# EAGLE design Prototipo_3X (EAGLE 6.1)
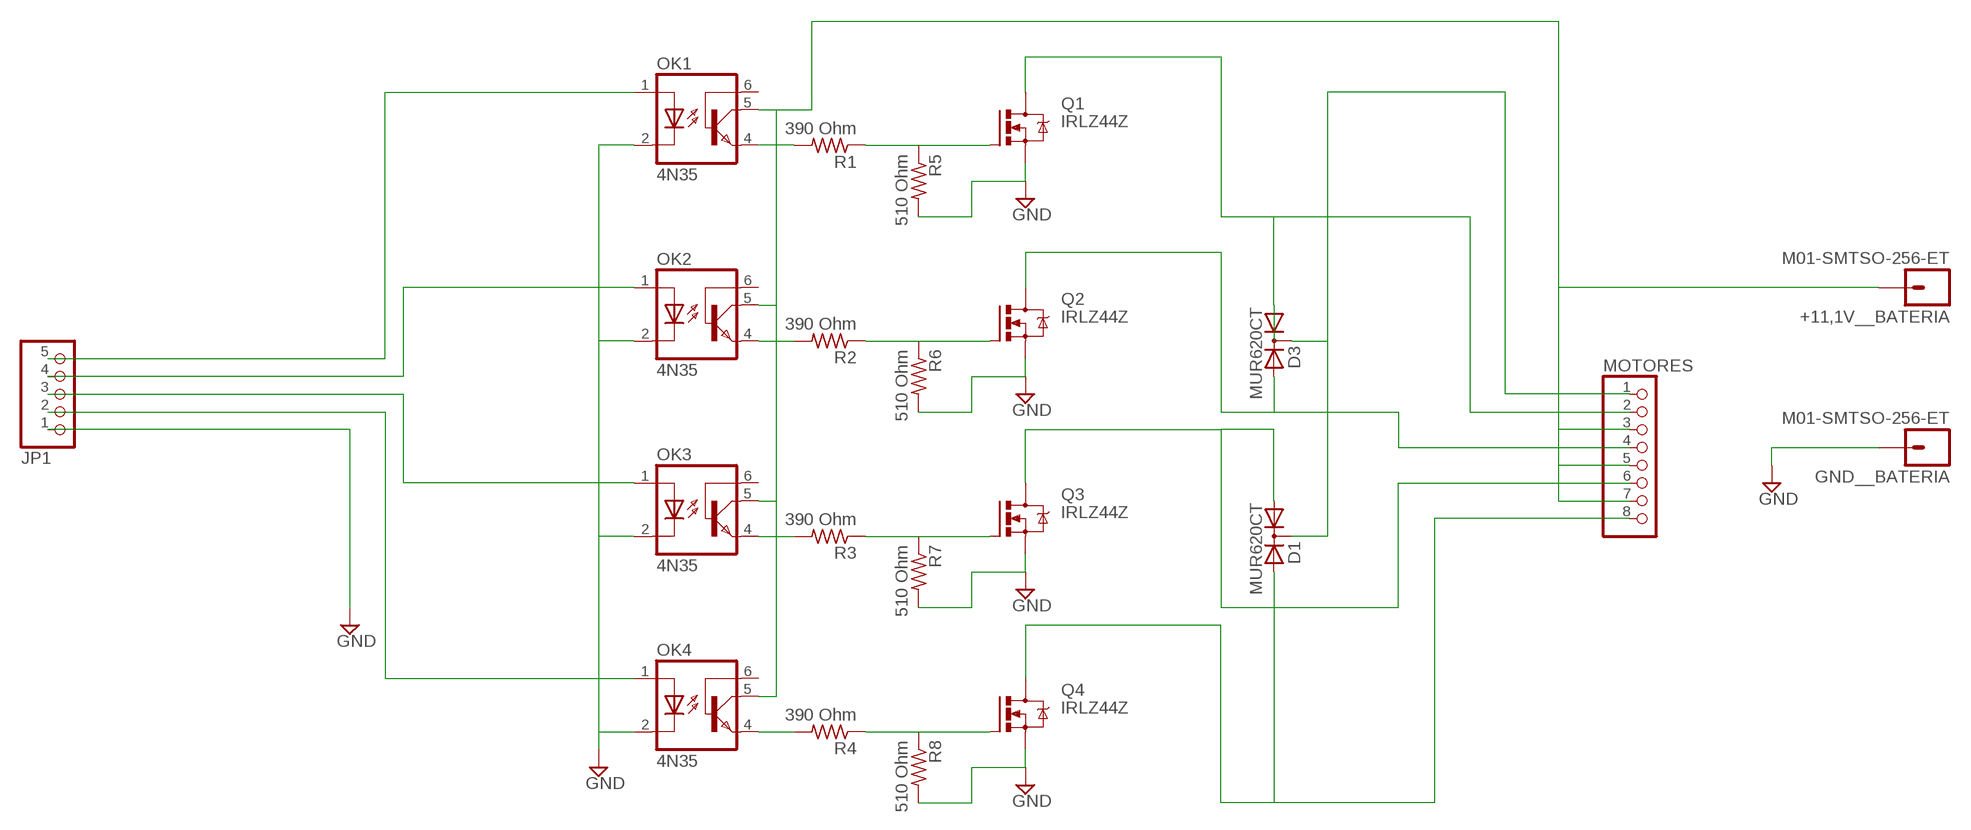
[diagram p0: schematic, sheet 1]

## Parts
+11,1V__BATERIA  M01-SMTSO-256-ET  [SMTSO-256-ET]
D1  MUR620CT  [TO220AB]
D3  MUR620CT  [TO220AB]
GND__BATERIA  M01-SMTSO-256-ET  [SMTSO-256-ET]
JP1  PINHD-1X5/90  [1X05/90]
MOTORES  PINHD-1X8/90  [1X08/90]
OK1  4N35  [DIL06]
OK2  4N35  [DIL06]
OK3  4N35  [DIL06]
OK4  4N35  [DIL06]
Q1  IRLZ44Z  [TO220BH]
Q2  IRLZ44Z  [TO220BH]
Q3  IRLZ44Z  [TO220BH]
Q4  IRLZ44Z  [TO220BH]
R1  390 Ohm  R-US_0207/7  [0207/7]
R2  390 Ohm  R-US_0207/7  [0207/7]
R3  390 Ohm  R-US_0207/7  [0207/7]
R4  390 Ohm  R-US_0207/7  [0207/7]
R5  510 Ohm  R-US_0207/7  [0207/7]
R6  510 Ohm  R-US_0207/7  [0207/7]
R7  510 Ohm  R-US_0207/7  [0207/7]
R8  510 Ohm  R-US_0207/7  [0207/7]

## Nets
GND [power]: GND__BATERIA.P$1 JP1.1 OK1.2(C) OK2.2(C) OK3.2(C) OK4.2(C) Q1.S Q2.S Q3.S Q4.S R5.2 R6.2 R7.2 R8.2
N$1: JP1.5 OK1.1(A)
N$2: JP1.4 OK2.1(A)
N$3: JP1.3 OK3.1(A)
N$4: JP1.2 OK4.1(A)
N$5: OK1.4(EMI) R1.2
N$6: Q1.G R1.1 R5.1
N$7: OK2.4(EMI) R2.2
N$8: OK3.4(EMI) R3.2
N$9: OK4.4(EMI) R4.2
N$10: Q4.G R4.1 R8.1
N$11: D3.A1 MOTORES.2 Q1.D
N$13: Q3.G R3.1 R7.1
N$14: D3.A2 MOTORES.4 Q2.D
N$15: D1.A1 MOTORES.6 Q3.D
N$16: D1.A2 MOTORES.8 Q4.D
N$17: Q2.G R2.1 R6.1
N$18: +11,1V__BATERIA.P$1 D1.C D3.C MOTORES.1 MOTORES.3 MOTORES.5 MOTORES.7 OK1.5(COL) OK2.5(COL) OK3.5(COL) OK4.5(COL)
Unconnected: OK1.6(BAS) OK2.6(BAS) OK3.6(BAS) OK4.6(BAS)

## Library data of the parts
+11,1V__BATERIA GND__BATERIA = SparkFun-Connectors:M01: Header 1 Standard 1-pin 0.1" header. Use with straight break away headers (SKU : PRT-00116), right angle break away headers (PRT-00553), swiss pins (PRT-00743), machine pins (PRT-00117), and female headers (PRT-00115).
D1 D3 = diode:MUR620CT: DIODE dual rectifier, 6 A, 200 V, common cathode
JP1 = pinhead:PINHD-1X5: PIN HEADER
MOTORES = pinhead:PINHD-1X8: PIN HEADER
OK1-OK4 = optocoupler:4N35: MOTOROLA OPTO COUPLER; MF: FAIRCHILD SEMICONDUCTOR; MPN: 4N35; OC_FARNELL: 1328375; OC_NEWARK: 72K9946
Q1-Q4 = transistor-power:IRLZ44Z: N-Channel HEXFET® Power MOSFET Logic Level AUTOMOTIVE MOSFET Source: http://www.irf.com/product-info/datasheets/data/irlz44zpbf.pdf
R1-R8 = resistor:R-US_: RESISTOR, American symbol

## Net classes
0 default: clearance 0.205 mm
1 power: width 0.655 mm, drill 10.22 mm, clearance 0.205 mm to class 0, clearance 0.205 mm

## Board
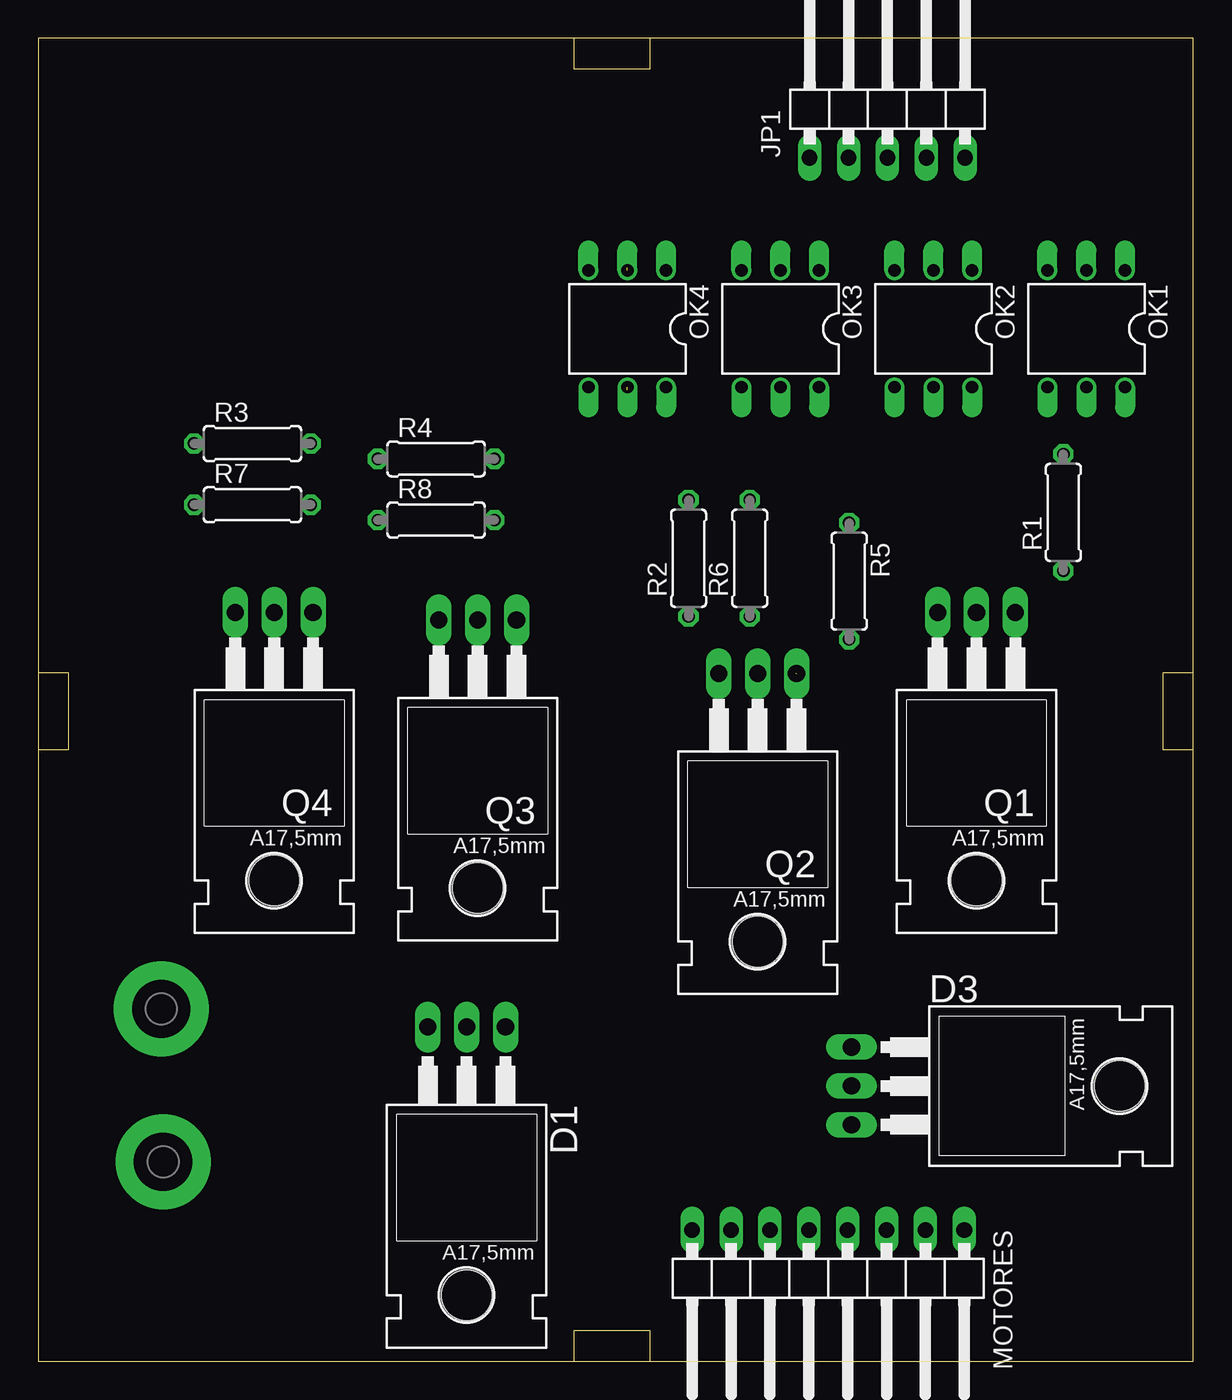
[diagram p1: board, top side]
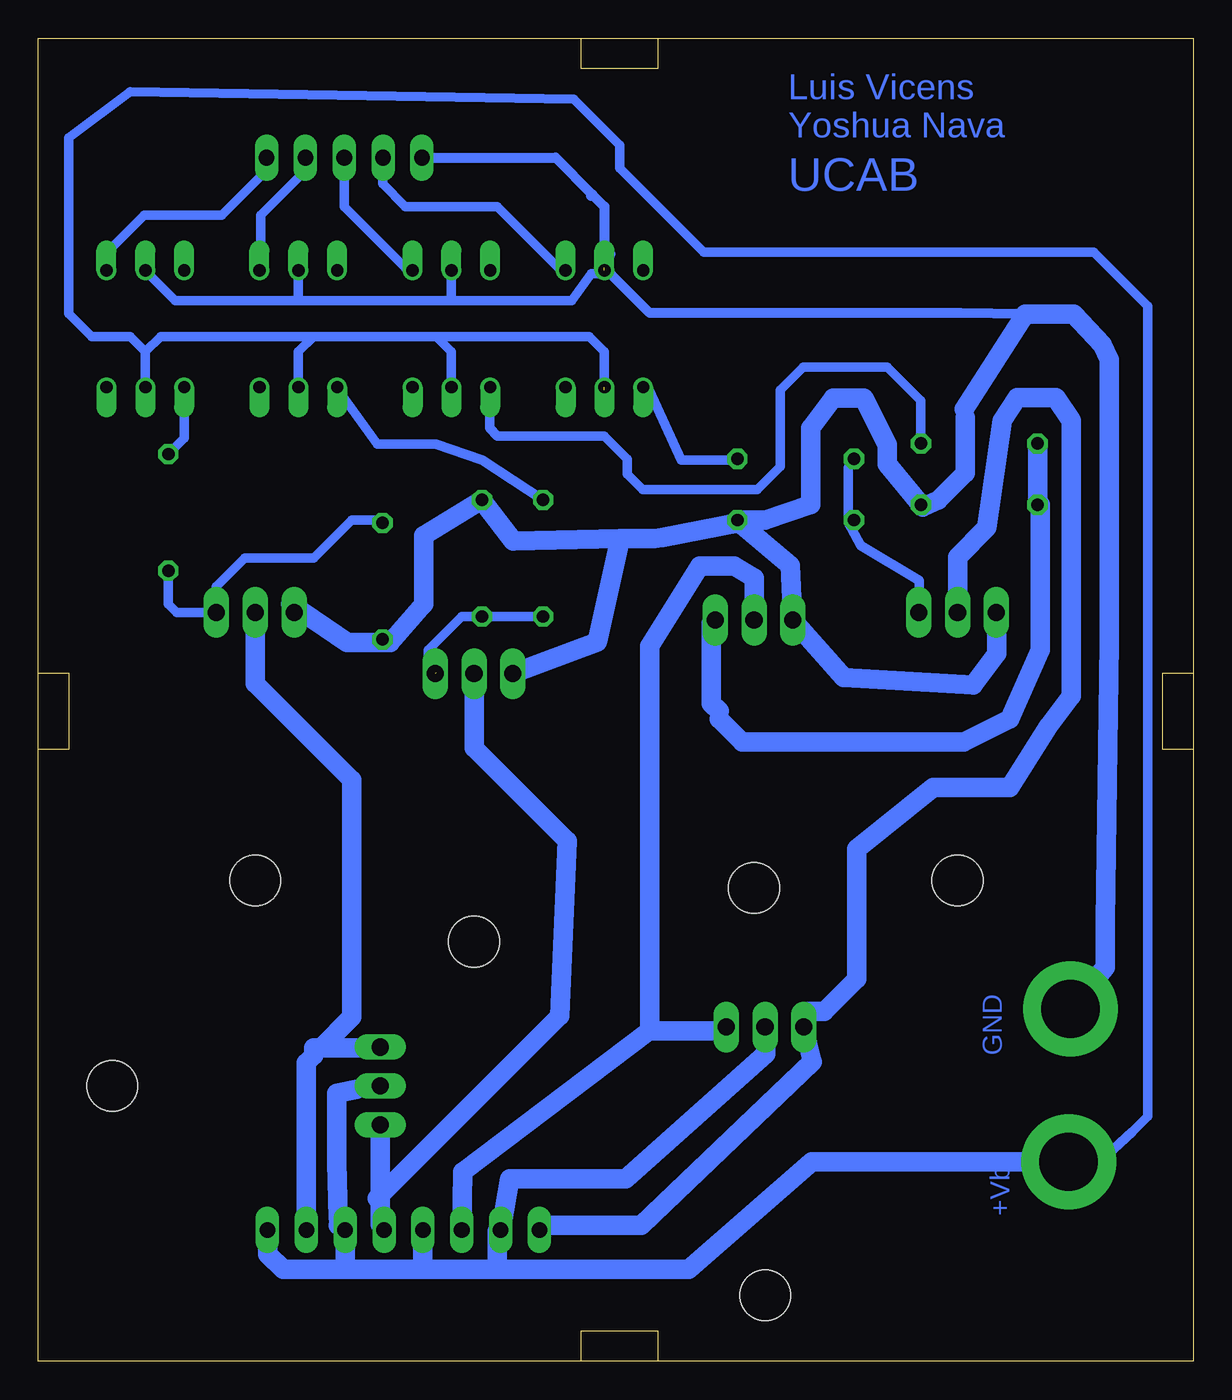
[diagram p2: board, bottom side, seen from below]

Size 75.5 x 86.5 mm. Coordinates in mm from the lower left corner, seen from the top.
Outline: 0,0 75.5,0 75.5,86.5 0,86.5 0,0
Copper layers (1*16): Top 0.035mm / dielectric 1.5mm / Bottom 0.035mm
Design rules: minimum track width 10mil, minimum drill 24mil, track to track 8mil, track to pad 8mil, pad to pad 8mil, via to via 8mil, smd to smd 8mil, copper to edge 40mil, drill to drill 8mil, minimum pad ring 10mil, minimum via ring 8mil, stop-mask expansion 4mil, vias tented up to drill 0mil, thermal gap 10mil

### Footprints (pad centres in the part's own frame; a part is rotated, then mirrored left to right if it is on the bottom)
SMTSO-256-ET = drill 3.81 pad 6.198: P$1 0,0
TO220AB = drill 1.118 long: A1 -2.54,-6.35; A2 2.54,-6.35; C 0,-6.35 | hole 3.302: 0,11.176
1X05/90 = drill 1.016 long: 1 -5.08,-3.81; 2 -2.54,-3.81; 3 0,-3.81; 4 2.54,-3.81; 5 5.08,-3.81
1X08/90 = drill 1.016 long: 1 -8.89,-3.81; 2 -6.35,-3.81; 3 -3.81,-3.81; 4 -1.27,-3.81; 5 1.27,-3.81; 6 3.81,-3.81; 7 6.35,-3.81; 8 8.89,-3.81
DIL06 = drill 0.813 offset: 1 -2.54,-3.81; 2 0,-3.81; 3 2.54,-3.81; 4 2.54,3.81; 5 0,3.81; 6 -2.54,3.81
TO220BH = drill 1.118 long: D 0,-6.35; G -2.54,-6.35; S 2.54,-6.35 | hole 3.302: 0,11.176
0207/7 = drill 0.813 octagon: 1 -3.81,0; 2 3.81,0

### Placement (x,y rotation side)
+11,1V__BATERIA  8.16,13.04 180 top
D1  28,15.5 180 top
D3  59.5,18 270 top
GND__BATERIA  8.04,23.04 0 top
JP1  55.5,82.5 0 top
MOTORES  51.63,4.78 180 top
OK1  68.5,67.5 180 top
OK2  58.5,67.5 180 top
OK3  48.5,67.5 180 top
OK4  38.5,67.5 180 top
Q1  61.32,42.61 180 top
Q2  47.02,38.61 180 top
Q3  28.72,42.11 180 top
Q4  15.42,42.61 180 top
R1  67,55.5 90 top
R2  42.5,52.5 90 top
R3  14,60 0 top
R4  26,59 0 top
R5  53,51 270 top
R6  46.5,52.5 90 top
R7  14,56 0 top
R8  26,55 0 top

### Tracks (layer width: path | path; a pad name or v marks a point on that pad's centre or on a via)
GND  (1 unrouted)
  Bottom 0.254: 68.58,71.12 OK1.2
  Bottom 0.406: Q1.S 55.32,47
  Bottom 0.61: 38.1,71.12 39.37,71.12 40.64,69.35 48.5,69.35 | 48.5,69.35 58.5,69.35 | 58.5,69.35 66.54,69.35 68.31,71.12 68.58,71.12 | OK3.2 48.5,69.35 | OK2.2 58.5,69.35 | 14.93,61.69 arc90 14.99,62.25
  Bottom 0.655: 58.27,49.03 Q1.S | 17.7,55.84 R7.2 | 38.1,72.39 OK4.2 38.1,71.12 35.52,68.54 15.24,68.54 10.99,68.47 | JP1.1 41.69,78.69 39.28,76.28 | 39.28,76.28 38.5,75.5 38.5,71.5 | 39.37,76.2 39.28,76.28
  Bottom 1.27: 37.45,53.8 38.95,47.03 Q2.S | 14.93,61.69 14.93,58.07 16.68,56.32 17.7,55.84 20.01,58.65 20.01,59.92 21.55,62.96 23.54,62.96 25,61 25,56 28,55 R8.2 29.67,54.84 | Q4.S 12.85,46.26 14.39,44.22 22.86,44.72 Q3.S 26.36,52.03 29.67,54.84 | 37.45,53.8 35.25,53.8 34.71,53.84 29.67,54.84 | GND__BATERIA.P$1 5.78,25.74 5.78,28.72 5.5,47 5.5,65.5 5.96,66.46 7.81,68.46 10.66,68.46 10.99,68.47 14.99,62.25 | 52.5,47 50.31,49.5 50.31,54 R6.2 44.45,53.64 37.45,53.8 | 52.5,47 R5.2 | 52.5,47 55.32,47 59,49.5
N$1
  Bottom 0.61: OK1.1 71.12,72.39 68.58,74.93 63.5,74.93 60.96,77.47 JP1.5
N$2
  Bottom 0.61: OK2.1 60.96,72.39 60.96,74.93 58.42,77.47 JP1.4
N$3
  Bottom 0.61: JP1.3 55.5,75.5 51.5,71.5 51,71.5 51.04,71.46 OK3.1
N$4
  Bottom 0.61: OK4.1 41.31,71.31 45.5,75.5 51.5,75.5 53,77 53,78.5 52.96,78.54 JP1.2
N$5
  Bottom 0.61: OK1.4 65.96,60.35 R1.2
N$6
  Bottom 0.61: R1.1 67,49.5 66.46,48.96 Q1.G 63.86,50.64 62,52.5 57.5,52.5 55,55 53.19,55 R5.1
N$7
  Bottom 0.406: 55.88,63.5 OK2.4
  Bottom 0.61: 55.88,63.5 53.34,59.96 49.53,59.96 46.49,58.92 R2.2
N$8
  Bottom 0.406: 46,63.65 OK3.4
  Bottom 0.61: R3.2 17.81,62.81 20,65 25.5,65 27,63.5 27,58.5 28.5,57 36,57 37,58 37,59 38.5,60.5 45.5,60.5 46,61 46,63.65
N$9
  Bottom 0.254: 29.67,58.92 R4.2 | 35.56,63.5 OK4.4
  Bottom 0.61: 29.67,58.92 33.48,58.92 35.56,63.5
N$10
  Bottom 0.254: 22.55,58.42 R4.1 | 22.55,54.84 R8.1
  Bottom 0.61: 22.55,58.42 22.55,54.84 21.74,53.34 17.93,51.03 Q4.G
N$11
  Bottom 0.254: 53.34,20.32 D3.A1
  Bottom 1.27: MOTORES.2 57.98,19.52 57.5,20 57.5,20.5 57,20.5 | 57,20.5 53.19,20.5 D3.A1 | Q1.D 61.32,44.32 55,38 55,22.5 57,20.5
N$13
  Bottom 0.813: R7.1 10,56 | 31,42 31,42.5 | 31.5,48.22 Q3.G
  Bottom 1.27: R3.1 R7.1 | 10,56 10,46.5 12,42 15,40.5 29.5,40.5 31,42 | 31,42.5 31.5,43 31.5,48.22
N$14
  Bottom 0.254: 53.34,10.66 52.84,8.39 | 53.34,15.24 D3.A2
  Bottom 0.61: 46.99,44.76 Q2.D | 53.34,10.66 arc90 53.15,8.97
  Bottom 1.27: 52.84,8.39 MOTORES.4 | 46.99,44.76 46.99,40.1 40.91,34.02 41.41,22.59 53.34,10.66 | 53.15,8.97 D3.A2
N$15
  Bottom 0.254: 30.48,21.59 D1.A1
  Bottom 0.61: 35.52,21.59 35.56,21.59
  Bottom 1.27: 35.56,21.59 47.76,12.39 MOTORES.6 | 30.48,21.59 35.52,21.59 35.52,46.76 32.28,52 30,52 28.72,51.22 Q3.D
N$16
  Bottom 0.406: 25.4,22.86 25.14,22.86
  Bottom 0.61: 25.4,22.86 D1.A2
  Bottom 1.27: MOTORES.8 42.68,8.89 36.1,8.89 24.9,19.59 D1.A2 | 25.14,22.86 24.14,22.86 22,25 22,33.5 17,37.5 12,37.5 9.5,41.5 8,43.5 8,61.5 9,63 11.5,63 12.5,61.5 13.5,54.5 15.42,52.58 Q4.D
N$17  (1 unrouted)
  Bottom 0.61: R2.1 R6.1 47.81,48.69 50,46.5 50,45.5 49.5,45
N$18  (1 unrouted)
  Bottom 0.254: 53.34,17.78 D3.C | 45.22,8.89 MOTORES.7 | 55.88,8.89 55.88,9.38
  Bottom 0.61: 60.5,8.57 MOTORES.1 | 55.44,6.06 55.5,6 | 50.36,6.14 50.5,6 | 45.22,8.89 45.72,8.72 45.5,8.5 | 53.34,17.78 54.72,17.78 | 68.5,66 69.5,67 72,67 73.5,68.5 73.5,80 69.5,83 40.5,82.5 37.5,79.5 37.5,78 32,72.5 6.5,72.5 3,69 3,16 4,15 5.62,13.5 +11,1V__BATERIA.P$1 | OK1.5 68.5,66 | 68.5,66 67.5,67 57.5,67 | 57.5,67 49.5,67 | 49.5,67 39.5,67 38.5,66 38.5,63.5 | OK3.5 48.5,66 49.5,67 | OK2.5 58.5,66 57.5,67
  Bottom 1.27: 45.22,8.89 44.68,11.93 37.1,11.93 27.94,20.09 D1.C | +11,1V__BATERIA.P$1 24.96,13.04 33,6 45.5,6 | 45.5,6 50.5,6 55.5,6 59.5,6 60.5,7 60.5,8.57 | 55.44,6.06 MOTORES.3 55.88,8.89 | MOTORES.5 50.36,6.14 | 45.5,8.5 45.5,6 | 54.72,17.78 56,17.5 56,13 55.88,9.38 55.5,8.5

### Text on the board
Bottom: Luis Vicens | Yoshua Nava | UCAB | GND | +Vb